# EAGLE schematic Secon2014_final Schematic (EAGLE 7.1.0)
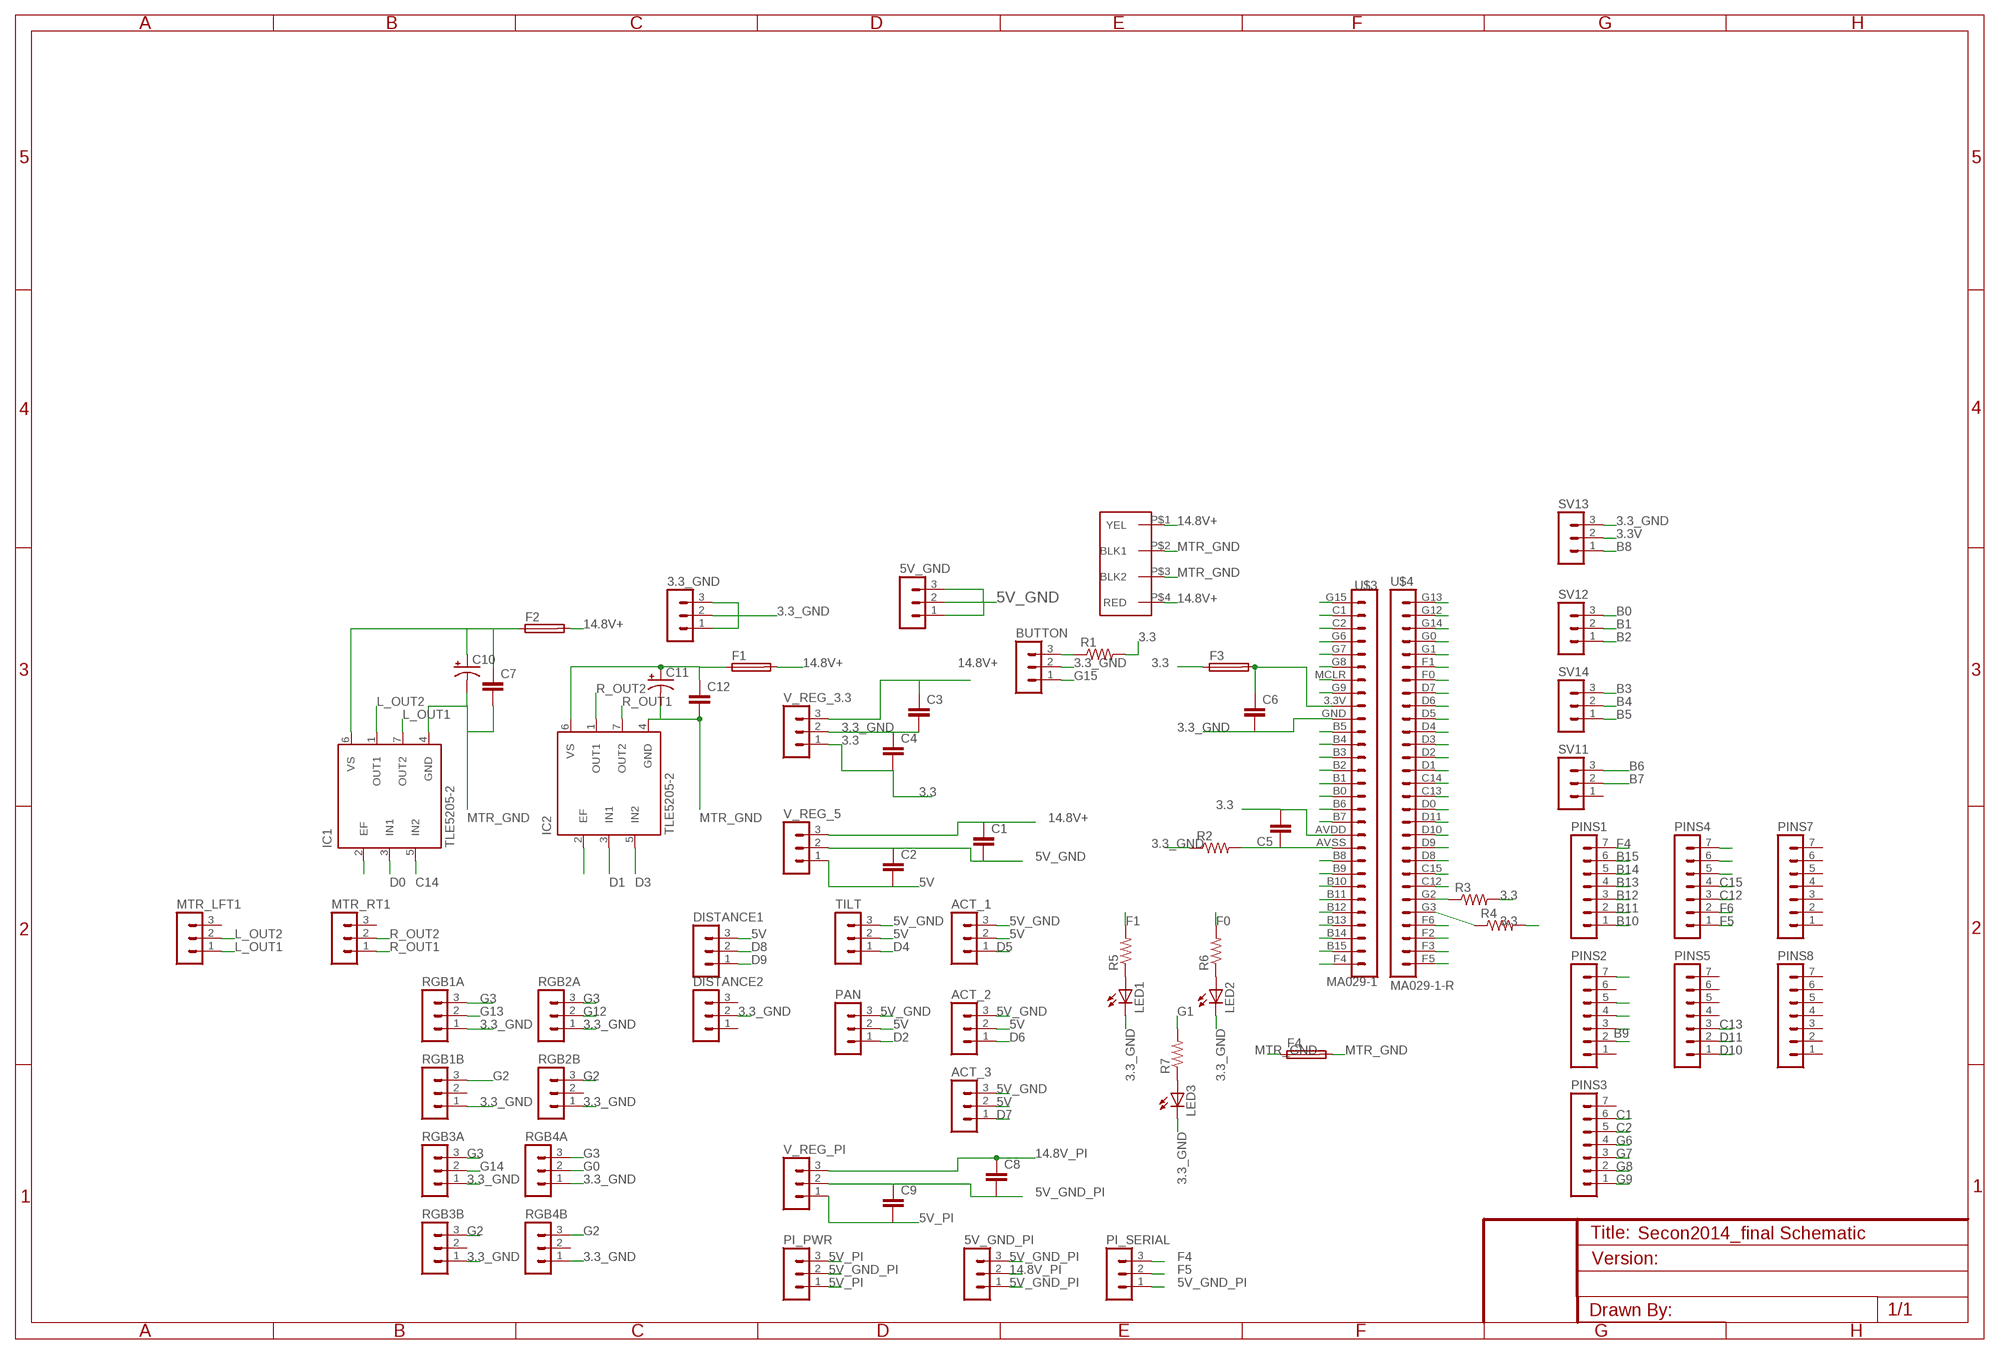
[diagram p0: schematic, sheet 1]

## Parts
3.3_GND  MA03-1  [MA03-1]
5V_GND  MA03-1  [MA03-1]
5V_GND_PI  MA03-1  [MA03-1]
ACT_1  MA03-1  [MA03-1]
ACT_2  MA03-1  [MA03-1]
ACT_3  MA03-1  [MA03-1]
BUTTON  MA03-1  [MA03-1]
C1  CAPPTH2  [CAP-PTH-SMALL2]
C2  CAPPTH2  [CAP-PTH-SMALL2]
C3  CAPPTH2  [CAP-PTH-SMALL2]
C4  CAPPTH2  [CAP-PTH-SMALL2]
C5  CAPPTH2  [CAP-PTH-SMALL2]
C6  CAPPTH2  [CAP-PTH-SMALL2]
C7  CAPPTH2  [CAP-PTH-SMALL2]
C8  CAPPTH2  [CAP-PTH-SMALL2]
C9  CAPPTH2  [CAP-PTH-SMALL2]
C10  CAP_POLPTH1  [CPOL-RADIAL-100UF-25V]
C11  CAP_POLPTH1  [CPOL-RADIAL-100UF-25V]
C12  CAPPTH2  [CAP-PTH-SMALL2]
DISTANCE1  MA03-1  [MA03-1]
DISTANCE2  MA03-1  [MA03-1]
F1  TE5  [TE5]
F2  TE5  [TE5]
F3  TE5  [TE5]
F4  TE5  [TE5]
IC1  TLE5205-2  [P-TO220-7-11]
IC2  TLE5205-2  [P-TO220-7-11]
LED1  LED5MM  [LED5MM]
LED2  LED5MM  [LED5MM]
LED3  LED5MM  [LED5MM]
MTR_LFT1  MA03-1  [MA03-1]
MTR_RT1  MA03-1  [MA03-1]
PAN  MA03-1  [MA03-1]
PI_PWR  MA03-1  [MA03-1]
PI_SERIAL  MA03-1  [MA03-1]
PINS1  MA07-1  [MA07-1]
PINS2  MA07-1  [MA07-1]
PINS3  MA07-1  [MA07-1]
PINS4  MA07-1  [MA07-1]
PINS5  MA07-1  [MA07-1]
PINS7  MA07-1  [MA07-1]
PINS8  MA07-1  [MA07-1]
R1  RESISTORPTH-1/4W  [AXIAL-0.4]
R2  RESISTORPTH-1/4W  [AXIAL-0.4]
R3  RESISTORPTH-1/4W  [AXIAL-0.4]
R4  RESISTORPTH-1/4W  [AXIAL-0.4]
R5  RESISTORPTH-1/4W  [AXIAL-0.4]
R6  RESISTORPTH-1/4W  [AXIAL-0.4]
R7  RESISTORPTH-1/4W  [AXIAL-0.4]
RGB1A  MA03-1  [MA03-1]
RGB1B  MA03-1  [MA03-1]
RGB2A  MA03-1  [MA03-1]
RGB2B  MA03-1  [MA03-1]
RGB3A  MA03-1  [MA03-1]
RGB3B  MA03-1  [MA03-1]
RGB4A  MA03-1  [MA03-1]
RGB4B  MA03-1  [MA03-1]
SV11  MA03-1  [MA03-1]
SV12  MA03-1  [MA03-1]
SV13  MA03-1  [MA03-1]
SV14  MA03-1  [MA03-1]
TILT  MA03-1  [MA03-1]
U$1  MOLEX-4PINPWR  [MOLEX_4PWR]
U$3  MA029-1  [MA029-1]
U$4  MA029-1-R  [MA029-1-R]
V_REG_3.3  MA03-1  [MA03-1]
V_REG_5  MA03-1  [MA03-1]
V_REG_PI  MA03-1  [MA03-1]

## Nets
3.3 [POWER]: C4.2 C5.2 F3.1 R1.P$2 R3.P$2 R4.P$2 U$3.AVDD V_REG_3.3.1
3.3_GND [POWER]: 3.3_GND.1 3.3_GND.2 3.3_GND.3 BUTTON.2 C3.2 C4.1 C6.2 DISTANCE2.2 LED1.K(C) LED2.K(C) LED3.K(C) R2.P$1 RGB1A.1 RGB1B.1 RGB2A.1 RGB2B.1 RGB3A.1 RGB3B.1 RGB4A.1 RGB4B.1 SV13.3 U$3.GND V_REG_3.3.2
3.3V: SV13.2
5V [POWER]: ACT_1.2 ACT_2.2 ACT_3.2 C2.2 DISTANCE1.3 PAN.2 TILT.2 V_REG_5.1
5V_GND [POWER2]: 5V_GND.1 5V_GND.2 5V_GND.3 ACT_1.3 ACT_2.3 ACT_3.3 C1.2 C2.1 PAN.3 TILT.3 V_REG_5.2
5V_GND_PI [POWER2]: 5V_GND_PI.1 5V_GND_PI.3 C8.2 C9.1 PI_PWR.2 PI_SERIAL.1 V_REG_PI.2
5V_PI [POWER]: C9.2 PI_PWR.1 PI_PWR.3 V_REG_PI.1
14.8V+ [POWER2]: C1.1 C3.1 F1.2 F2.2 U$1.P$1(YEL) U$1.P$4(RED) V_REG_3.3.3 V_REG_5.3
14.8V_PI [POWER2]: 5V_GND_PI.2 C8.1 V_REG_PI.3
B0: SV12.3 U$3.B0
B1: SV12.2 U$3.B1
B2: SV12.1 U$3.B2
B3: SV14.3 U$3.B3
B4: SV14.2 U$3.B4
B5: SV14.1 U$3.B5
B6: SV11.3 U$3.B6
B7: SV11.2 U$3.B7
B8: SV13.1 U$3.B8
B9: PINS2.2 U$3.B9
B10: PINS1.1 U$3.B10
B11: PINS1.2 U$3.B11
B12: PINS1.3 U$3.B12
B13: PINS1.4 U$3.B13
B14: PINS1.5 U$3.B14
B15: PINS1.6 U$3.B15
C1: PINS3.6 U$3.C1
C2: PINS3.5 U$3.C2
C12: PINS4.3 U$4.C12
C13: PINS5.3 U$4.C13
C14: IC1.5(IN2) U$4.C14
C15: PINS4.4 U$4.C15
D0: IC1.3(IN1) U$4.D0
D1: IC2.3(IN1) U$4.D1
D2: PAN.1 U$4.D2
D3: IC2.5(IN2) U$4.D3
D4: TILT.1 U$4.D4
D5: ACT_1.1 U$4.D5
D6: ACT_2.1 U$4.D6
D7: ACT_3.1 U$4.D7
D8: DISTANCE1.2 U$4.D8
D9: DISTANCE1.1 U$4.D9
D10: PINS5.1 U$4.D10
D11: PINS5.2 U$4.D11
F0: R6.P$2 U$4.F0
F1: R5.P$2 U$4.F1
F2: U$4.F2
F3: U$4.F3
F4: PI_SERIAL.3 PINS1.7 U$3.F4
F5: PI_SERIAL.2 PINS4.1 U$4.F5
F6: PINS4.2 U$4.F6
FUSE1OUT [POWER2]: C11.1(+) C12.1 F1.1 IC2.6(VS)
FUSE2OUT [POWER2]: C7.1 C10.1(+) F2.1 IC1.6(VS)
FUSE3OUT [POWER]: C6.1 F3.2 U$3.3.3V
G0: RGB4A.2 U$4.G0
G1: R7.P$2 U$4.G1
G2: RGB1B.3 RGB2B.3 RGB3B.3 RGB4B.3
G3: RGB1A.3 RGB2A.3 RGB3A.3 RGB4A.3
G4: R3.P$1 U$4.G2
G5: R4.P$1 U$4.G3
G6: PINS3.4 U$3.G6
G7: PINS3.3 U$3.G7
G8: PINS3.2 U$3.G8
G9: PINS3.1 U$3.G9
G12: RGB2A.2 U$4.G12
G13: RGB1A.2 U$4.G13
G14: RGB3A.2 U$4.G14
G15: BUTTON.1 U$3.G15
L_OUT1: IC1.7(OUT2) MTR_LFT1.1
L_OUT2: IC1.1(OUT1) MTR_LFT1.2
MCLR: U$3.MCLR
MTR_GND [POWER2]: C7.2 C10.2(-) C11.2(-) C12.2 F4.1 F4.2 IC1.4(GND) IC2.4(GND) U$1.P$2(BLK1) U$1.P$3(BLK2)
N$1: C5.1 R2.P$2 U$3.AVSS
N$2: BUTTON.3 R1.P$1
N$3: LED2.A R6.P$1
N$4: PINS2.7
N$6: PINS4.7
N$7: PINS4.6
N$8: PINS4.5
N$9: LED3.A R7.P$1
N$10: IC1.2(EF)
N$11: LED1.A R5.P$1
N$14: PINS2.5
N$15: IC2.2(EF)
N$16: PINS2.4
N$17: PINS2.3
R_OUT1: IC2.7(OUT2) MTR_RT1.1
R_OUT2: IC2.1(OUT1) MTR_RT1.2
Unconnected: DISTANCE2.1 DISTANCE2.3 MTR_LFT1.3 MTR_RT1.3 PINS2.1 PINS2.6 PINS3.7 PINS5.4 PINS5.5 PINS5.6 PINS5.7 PINS7.1 PINS7.2 PINS7.3 PINS7.4 PINS7.5 PINS7.6 PINS7.7 PINS8.1 PINS8.2 PINS8.3 PINS8.4 PINS8.5 PINS8.6 PINS8.7 RGB1B.2 RGB2B.2 RGB3B.2 RGB4B.2 SV11.1

## Library data of the parts
3.3_GND 5V_GND 5V_GND_PI ACT_1-ACT_3 BUTTON DISTANCE1 DISTANCE2 MTR_LFT1 MTR_RT1 PAN PI_PWR PI_SERIAL RGB1A RGB1B RGB2A RGB2B RGB3A RGB3B RGB4A RGB4B SV11-SV14 TILT V_REG_3.3 V_REG_5 V_REG_PI = con-lstb:MA03-1: PIN HEADER; OC_FARNELL: unknown; OC_NEWARK: unknown
C1-C9 C12 = SparkFun:CAP: Capacitor Standard 0603 ceramic capacitor, and 0.1" leaded capacitor.
C10 C11 = SparkFun:CAP_POL: Capacitor Polarized These are standard SMD and PTH capacitors. Normally 10uF, 47uF, and 100uF in electrolytic and tantalum varieties. Always verify the external diameter of the through hole cap, it varies with capacity, voltage, and manufacturer. The EIA devices should be standard.
F1-F4 = fuse:TE5: FUSE Wickmann; OC_FARNELL: unknown; OC_NEWARK: unknown
IC1 IC2 = infineon:TLE5205-2: 5-A H-Bridge for DC-Motor Applications Source: http://www.infineon.com .. tle5205-2.pdf; OC_FARNELL: unknown; OC_NEWARK: unknown
LED1-LED3 = led:LED: LED OSRAM: - CHIPLED LG R971, LG N971, LY N971, LG Q971, LY Q971, LO R971, LY R971 LH N974, LH R974 LS Q976, LO Q976, LY Q976 LO Q996 - Hyper CHIPLED LW Q18S LB Q993, LB Q99A, LB R99A - SideLED LS A670, LO A670, LY A670, LG A670, LP A670 LB A673, LV A673, LT A673, LW A673 LH A674 LY A675 LS A676, LA A676, LO A676, LY A676, LW A676 LS A679, LY A679, LG A679 - Hyper Micro SIDELED® LS Y876, LA Y876, LO Y876, LY Y876 LT Y87S - SmartLED LW L88C, LW L88S LB L89C, LB L89S, LG L890 LS L89K, LO L89K, LY L89K LS L896, LA L896, LO L896, LY L896 - TOPLED LS T670, LO T670, LY T670, LG T670, LP T670 LSG T670, LSP T670, LSY T670, LOP T670, LYG T670 LG T671, LOG T671, LSG T671 LB T673, LV T673, LT T673, LW T673 LH T674 LS T676, LA T676, LO T676, LY T676, LB T676, LH T676, LSB T676, LW T676 LB T67C, LV T67C, LT T67C, LS T67K, LO T67K, LY T67K, LW E67C LS E67B, LA E67B, LO E67B, LY E67B, LB E67C, LV E67C, LT E67C LW T67C LS T679, LY T679, LG T679 LS T770, LO T770, LY T770, LG T770, LP T770 LB T773, LV T773, LT T773, LW T773 LH T774 LS E675, LA E675, LY E675, LS T675 LS T776, LA T776, LO T776, LY T776, LB T776 LHGB T686 LT T68C, LB T68C - Hyper Mini TOPLED® LB M676 - Mini TOPLED Santana® LG M470 LS M47K, LO M47K, LY M47K Source: http://www.osram.convergy.de LUXEON: - LUMILED® LXK2-PW12-R00, LXK2-PW12-S00, LXK2-PW14-U00, LXK2-PW14-V00 LXK2-PM12-R00, LXK2-PM12-S00, LXK2-PM14-U00 LXK2-PE12-Q00, LXK2-PE12-R00, LXK2-PE12-S00, LXK2-PE14-T00, LXK2-PE14-U00 LXK2-PB12-K00, LXK2-PB12-L00, LXK2-PB12-M00, LXK2-PB14-N00, LXK2-PB14-P00, LXK2-PB14-Q00 LXK2-PR12-L00, LXK2-PR12-M00, LXK2-PR14-Q00, LXK2-PR14-R00 LXK2-PD12-Q00, LXK2-PD12-R00, LXK2-PD12-S00 LXK2-PH12-R00, LXK2-PH12-S00 LXK2-PL12-P00, LXK2-PL12-Q00, LXK2-PL12-R00 Source: www.luxeon.com KINGBRIGHT: KA-3528ASYC Source: www.kingbright.com
PINS1-PINS5 PINS7 PINS8 = con-lstb:MA07-1: PIN HEADER; OC_FARNELL: unknown; OC_NEWARK: unknown
R1-R7 = SparkFun:RESISTOR: Resistor Basic schematic elements and footprints for 0603, 1206, and PTH resistors.
U$1 = cavity_laser:MOLEX-4PINPWR
U$3 = SparkFun:MA029-1
U$4 = SparkFun:MA029-1-R

## Net classes
1 POWER: width 0.508 mm
2 POWER2: width 2.54 mm